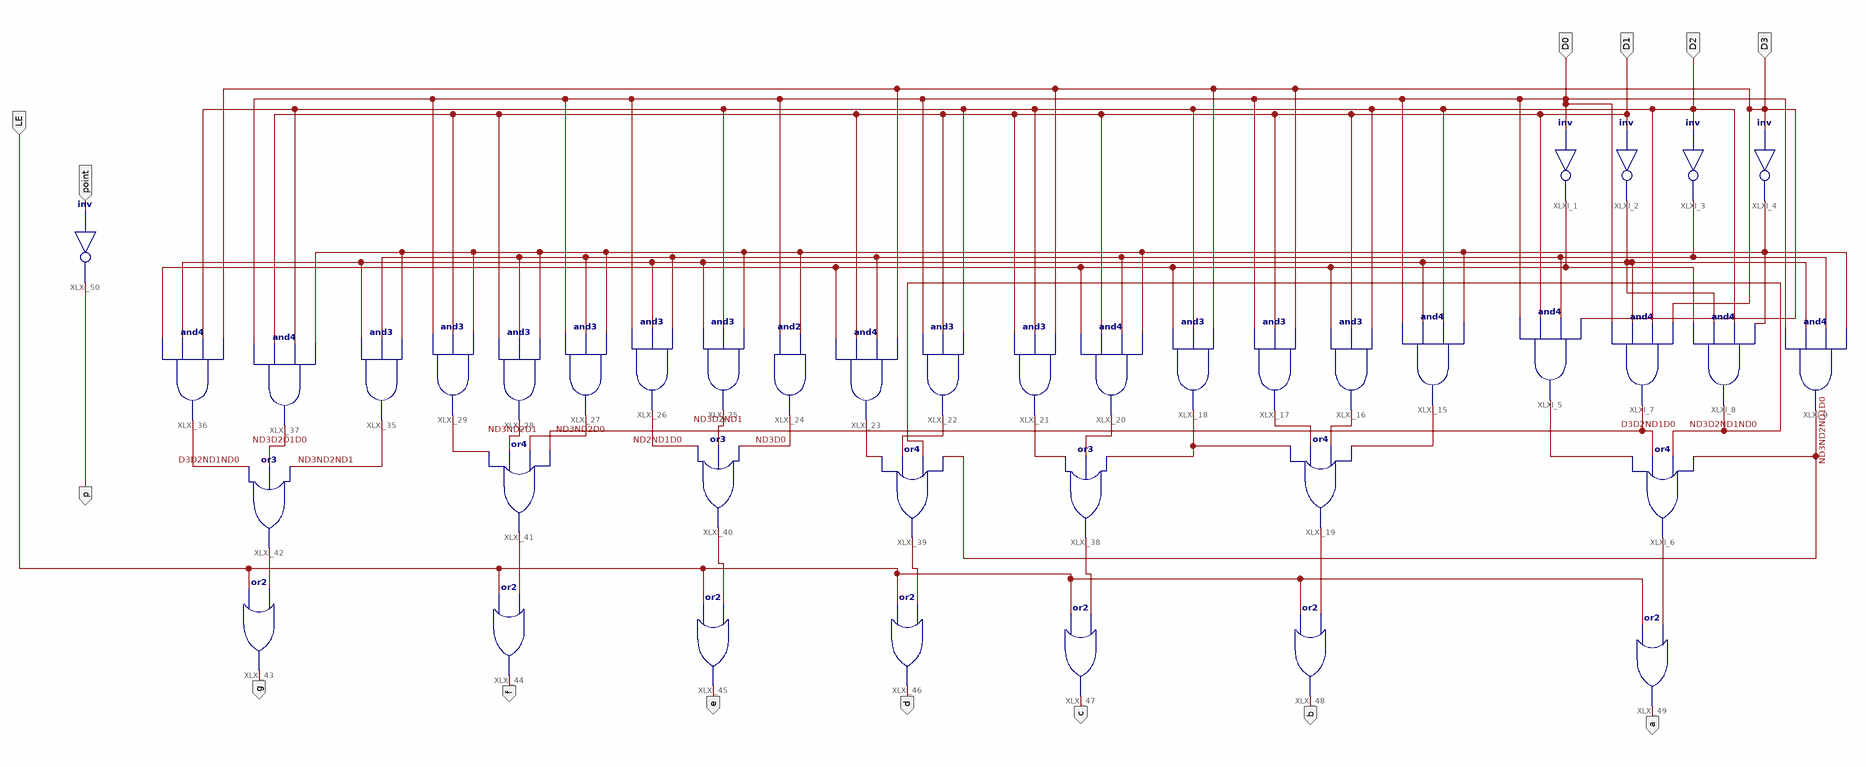
[diagram p0: schematic sheet 1]
// Xilinx ISE schematic MC14495_ZJU.sch (kintex7) as structural Verilog: 40 symbols, 14 ports
module MC14495_ZJU (
  input  D0,
  input  D1,
  input  D2,
  input  D3,
  input  LE,
  input  point,
  output p,
  output g,
  output f,
  output e,
  output d,
  output c,
  output b,
  output a
);

  wire D3D2ND1D0, D3D2ND1ND0, ND0, ND1, ND2, ND2ND1D0, ND3, ND3D0, ND3D1D0, ND3D2D1D0, ND3D2ND1, ND3D2ND1ND0,
       ND3ND2D0, ND3ND2D1, ND3ND2ND1, ND3ND2ND1D0, XLXN_44, XLXN_45, XLXN_46, XLXN_47, XLXN_48, XLXN_49,
       XLXN_50, XLXN_69, XLXN_71, XLXN_73, XLXN_74, XLXN_75, XLXN_76, XLXN_77, XLXN_78, XLXN_79;

  not XLXI_1 (ND0, D0);
  not XLXI_2 (ND1, D1);
  not XLXI_3 (ND2, D2);
  not XLXI_4 (ND3, D3);
  and XLXI_5 (XLXN_69, D0, D1, ND2, D3);
  and XLXI_7 (D3D2ND1D0, D0, ND1, D2, D3);
  and XLXI_8 (ND3D2ND1ND0, ND0, ND1, D2, ND3);
  and XLXI_9 (ND3ND2ND1D0, D0, ND1, ND2, ND3);
  or XLXI_6 (XLXN_50, XLXN_69, D3D2ND1D0, ND3D2ND1ND0, ND3ND2ND1D0);
  and XLXI_15 (XLXN_76, D0, ND1, D2, ND3);
  and XLXI_16 (XLXN_71, ND0, D1, D2);
  and XLXI_17 (XLXN_77, D0, D1, D3);
  and XLXI_18 (XLXN_73, ND0, D2, D3);
  or XLXI_19 (XLXN_49, XLXN_73, XLXN_77, XLXN_71, XLXN_76);
  and XLXI_20 (XLXN_74, ND0, D1, ND2, ND3);
  and XLXI_21 (XLXN_75, D1, D2, D3);
  and XLXI_22 (XLXN_79, D0, D1, D2);
  and XLXI_23 (XLXN_78, ND0, D1, ND2, D3);
  and XLXI_24 (ND3D0, D0, ND3);
  and XLXI_25 (ND3D2ND1, ND1, D2, ND3);
  and XLXI_26 (ND2ND1D0, D0, ND1, ND2);
  and XLXI_27 (ND3ND2D0, D0, ND2, ND3);
  and XLXI_28 (ND3ND2D1, D1, ND2, ND3);
  and XLXI_29 (ND3D1D0, D0, D1, ND3);
  and XLXI_35 (ND3ND2ND1, ND1, ND2, ND3);
  and XLXI_36 (D3D2ND1ND0, ND0, ND1, D2, D3);
  and XLXI_37 (ND3D2D1D0, D0, D1, D2, ND3);
  or XLXI_38 (XLXN_48, XLXN_75, XLXN_74, XLXN_73);
  or XLXI_39 (XLXN_47, XLXN_78, XLXN_79, ND3D2ND1ND0, ND3ND2ND1D0);
  or XLXI_40 (XLXN_46, ND2ND1D0, ND3D2ND1, ND3D0);
  or XLXI_41 (XLXN_45, ND3D1D0, ND3ND2D1, ND3ND2D0, D3D2ND1D0);
  or XLXI_42 (XLXN_44, D3D2ND1ND0, ND3D2D1D0, ND3ND2ND1);
  or XLXI_43 (g, LE, XLXN_44);
  or XLXI_44 (f, LE, XLXN_45);
  or XLXI_45 (e, LE, XLXN_46);
  or XLXI_46 (d, LE, XLXN_47);
  or XLXI_47 (c, LE, XLXN_48);
  or XLXI_48 (b, LE, XLXN_49);
  or XLXI_49 (a, LE, XLXN_50);
  not XLXI_50 (p, point);
endmodule
